# Altium schematic sheet PowerSupply.SchDoc
size A4; PageSetup: Record=PageOptions|CenterHorizontal=True|CenterVertical=True|PrintScale=0.97|XCorrection=1.00|YCorrection=1.00|PrintKind=2|BorderSize=5000000|LeftOffset=0|BottomOffset=0|Orientation=2|PaperLength=1000|PaperWidth=1000|Scale=100|PaperSource=7|PrintQuality=-3|MediaType=1|DitherType=10|PrintScaleMode=1|PaperKind=A4|PaperIndex=9
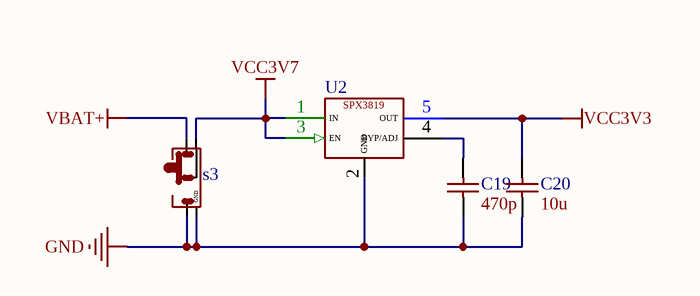
[diagram p0: PowerSupply.SchDoc]

## Parts
C19  value 470p  [C0402_h]  (hidden comment: Capacitor)
C20  value 10u  [C0402_h]  (hidden comment: Capacitor)
s3  switch  [侧动贴片开关]  (value not drawn)
U2  SPX3819  [SOT23-5]  (value not drawn)

## Nets
GND: C19.2 C20.2 s3.0(GND) s3.3(R) U2.2(GND)
VBAT+: s3.1(L)
VCC3V3: C20.1 U2.5(OUT)
VCC3V7: s3.2(mid) U2.1(IN) U2.3(EN)
NetC19_1: C19.1 U2.4(BYP/ADJ)

## Library data of the parts
C19 C20 = 贴片电容-无极性: VDC: 10V; Published: 8-Jun-2000; LatestRevisionDate: 17-Jul-2002; LatestRevisionNote: Re-released for DXP Platform.; PackageReference: RAD-0.3; Publisher: Altium Limited; PackageDescription: Radial Cap, Thru-Hole; 2 Leads; 0.3 in Pin Spacing
s3 = 拨动开关
U2 = SPX3819: 500mA, Low-Noise LDO Voltage Regulator